# EAGLE schematic panel-mount-orafice-mk-2.0 (EAGLE 6.5.0)
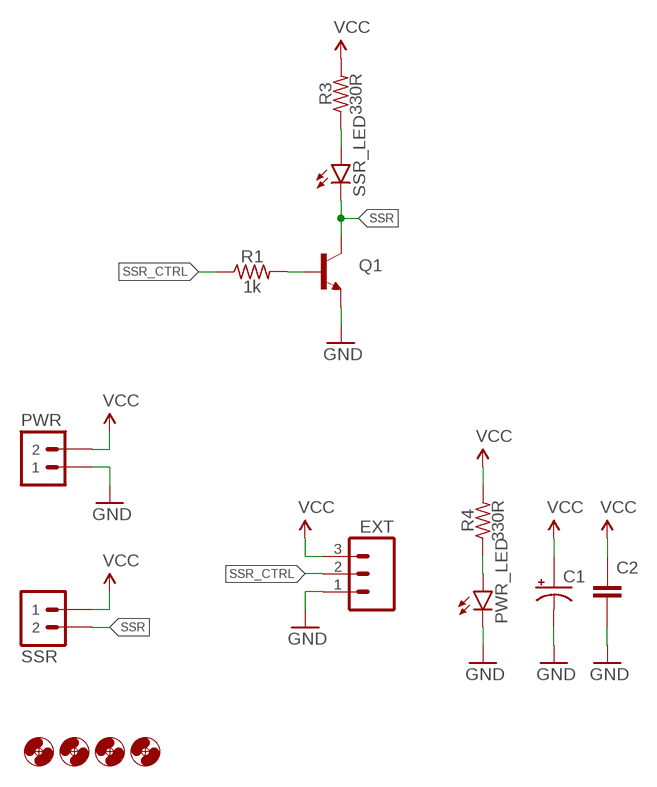
[diagram p0: schematic, sheet 1]

## Parts
C1  CAPACITOR-POLARIZEDE3.5-8  [E3,5-8]
C2  CAPACITOR-CERAMIC025-024X044  [C025-024X044]
EXT  M03JST-XH-RA-PTH  [JST-3-XH-RA-PTH]
H1  HOLE#2  [HOLE-#2]
H2  HOLE#2  [HOLE-#2]
H3  HOLE#2  [HOLE-#2]
H4  HOLE#2  [HOLE-#2]
PWR  M02JST-PTH-VERT  [JST-2-PH-VERT-PTH]
PWR_LED  LED3MM  [LED3MM]
Q1  TRANSISTOR_NPNTO-92-AMMO-EBC  [TO-92-AMMO]
R1  1k  RESISTORPTH-AXIAL-6.35MM  [RESISTOR-AXIAL-PTH-6.35MM]
R3  330R  RESISTORPTH-AXIAL-6.35MM  [RESISTOR-AXIAL-PTH-6.35MM]
R4  330R  RESISTORPTH-AXIAL-6.35MM  [RESISTOR-AXIAL-PTH-6.35MM]
SSR  M02JST-PTH-VERT  [JST-2-PH-VERT-PTH]
SSR_LED  LED3MM  [LED3MM]

## Nets
GND: C1.- C2.2 EXT.1 PWR.1 PWR_LED.K(C) Q1.1(E)
N$1: Q1.2(B) R1.P$2
N$4: R3.P$1 SSR_LED.A
N$5: PWR_LED.A R4.P$1
SSR: Q1.3(C) SSR.2 SSR_LED.K(C)
SSR_CTRL: EXT.2 R1.P$1
VCC: C1.+ C2.1 EXT.3 PWR.2 R3.P$2 R4.P$2 SSR.1

## Library data of the parts
C1 = A_butts:CAPACITOR-POLARIZED: POLARIZED CAPACITOR, American symbol
C2 = A_butts:CAPACITOR-CERAMIC: CAPACITOR, European symbol
EXT = A_butts:M03: Header 3 Standard 3-pin 0.1" header. Use with straight break away headers (SKU : PRT-00116), right angle break away headers (PRT-00553), swiss pins (PRT-00743), machine pins (PRT-00117), and female headers (PRT-00115). Molex polarized connector foot print use with SKU : PRT-08232 with associated crimp pins and housings.
H1-H4 = A_butts:HOLE: MOUNTING HOLE with drill center marker
PWR SSR = A_butts:M02: Standard 2-pin 0.1" header. Use with - straight break away headers ( PRT-00116) - right angle break away headers (PRT-00553) - swiss pins (PRT-00743) - machine pins (PRT-00117) - female headers (PRT-00115) Molex polarized connector foot print use with: PRT-08233 with associated crimp pins and housings. 2.54_SCREWTERM for use with PRT-10571. 3.5mm Screw Terminal footprints for PRT-08084 5mm Screw Terminal footprints for use with PRT-08433
PWR_LED SSR_LED = A_butts:LED: LEDs Standard schematic elements and footprints for 5mm, 3mm, 1206, and 0603 sized LEDs. 5mm - Spark Fun Electronics SKU : COM-00529 (and others)
Q1 = A_butts:TRANSISTOR_NPN: Generic NPN BJT MMBT2222A - TRANS-08049 (SOT-23, 1A 40V) MPSA42 - TRANS-09116 (SOT-23, 500mA 300V) MMBT5088LT1G - TRANS-11160 (SOT-23, 50 mA 30V) BC547 - COM-08928 <http://www.sparkfun.com/products/8928> (TO-92 45V 100mA) (1.Collector 2.Base 3.Emitter) 2N3904 - COM-00521 <http://www.sparkfun.com/products/521> (TO-92 40V 200mA) (1.Emitter 2.Base 3.Collector) P2N2222A - COM-12852 <http://www.sparkfun.com/products/12852> (TO-92 40V 600mA) (1.Collector 2.Base 3.Emitter)
R1 R3 R4 = A_butts:RESISTOR: RESISTOR, American symbol